# Altium schematic sheet USB_HUB.SchDoc: USB_HUB
size A3; Date: Not used; ApprovedBy: Not used; CheckedBy: Not used; Author: Not used; CompanyName: STMicroelectronics; DrawnBy: Not used; Engineer: Not used; Organization: Not used; Address1: Not used; Address2: Not used; Address3: Not used; Address4: Not used; DocumentNumber: Not used; Revision: Not used; SheetNumber: 14; SheetTotal: 18; CurrentTime: Not used; CurrentDate: Not used; Time: Not used; DocumentFullPathAndName: Not used; DocumentName: Not used; ModifiedDate: Not used; ImagePath: Not used; ProjectName: Not used; Application_BuildNumber: Not used
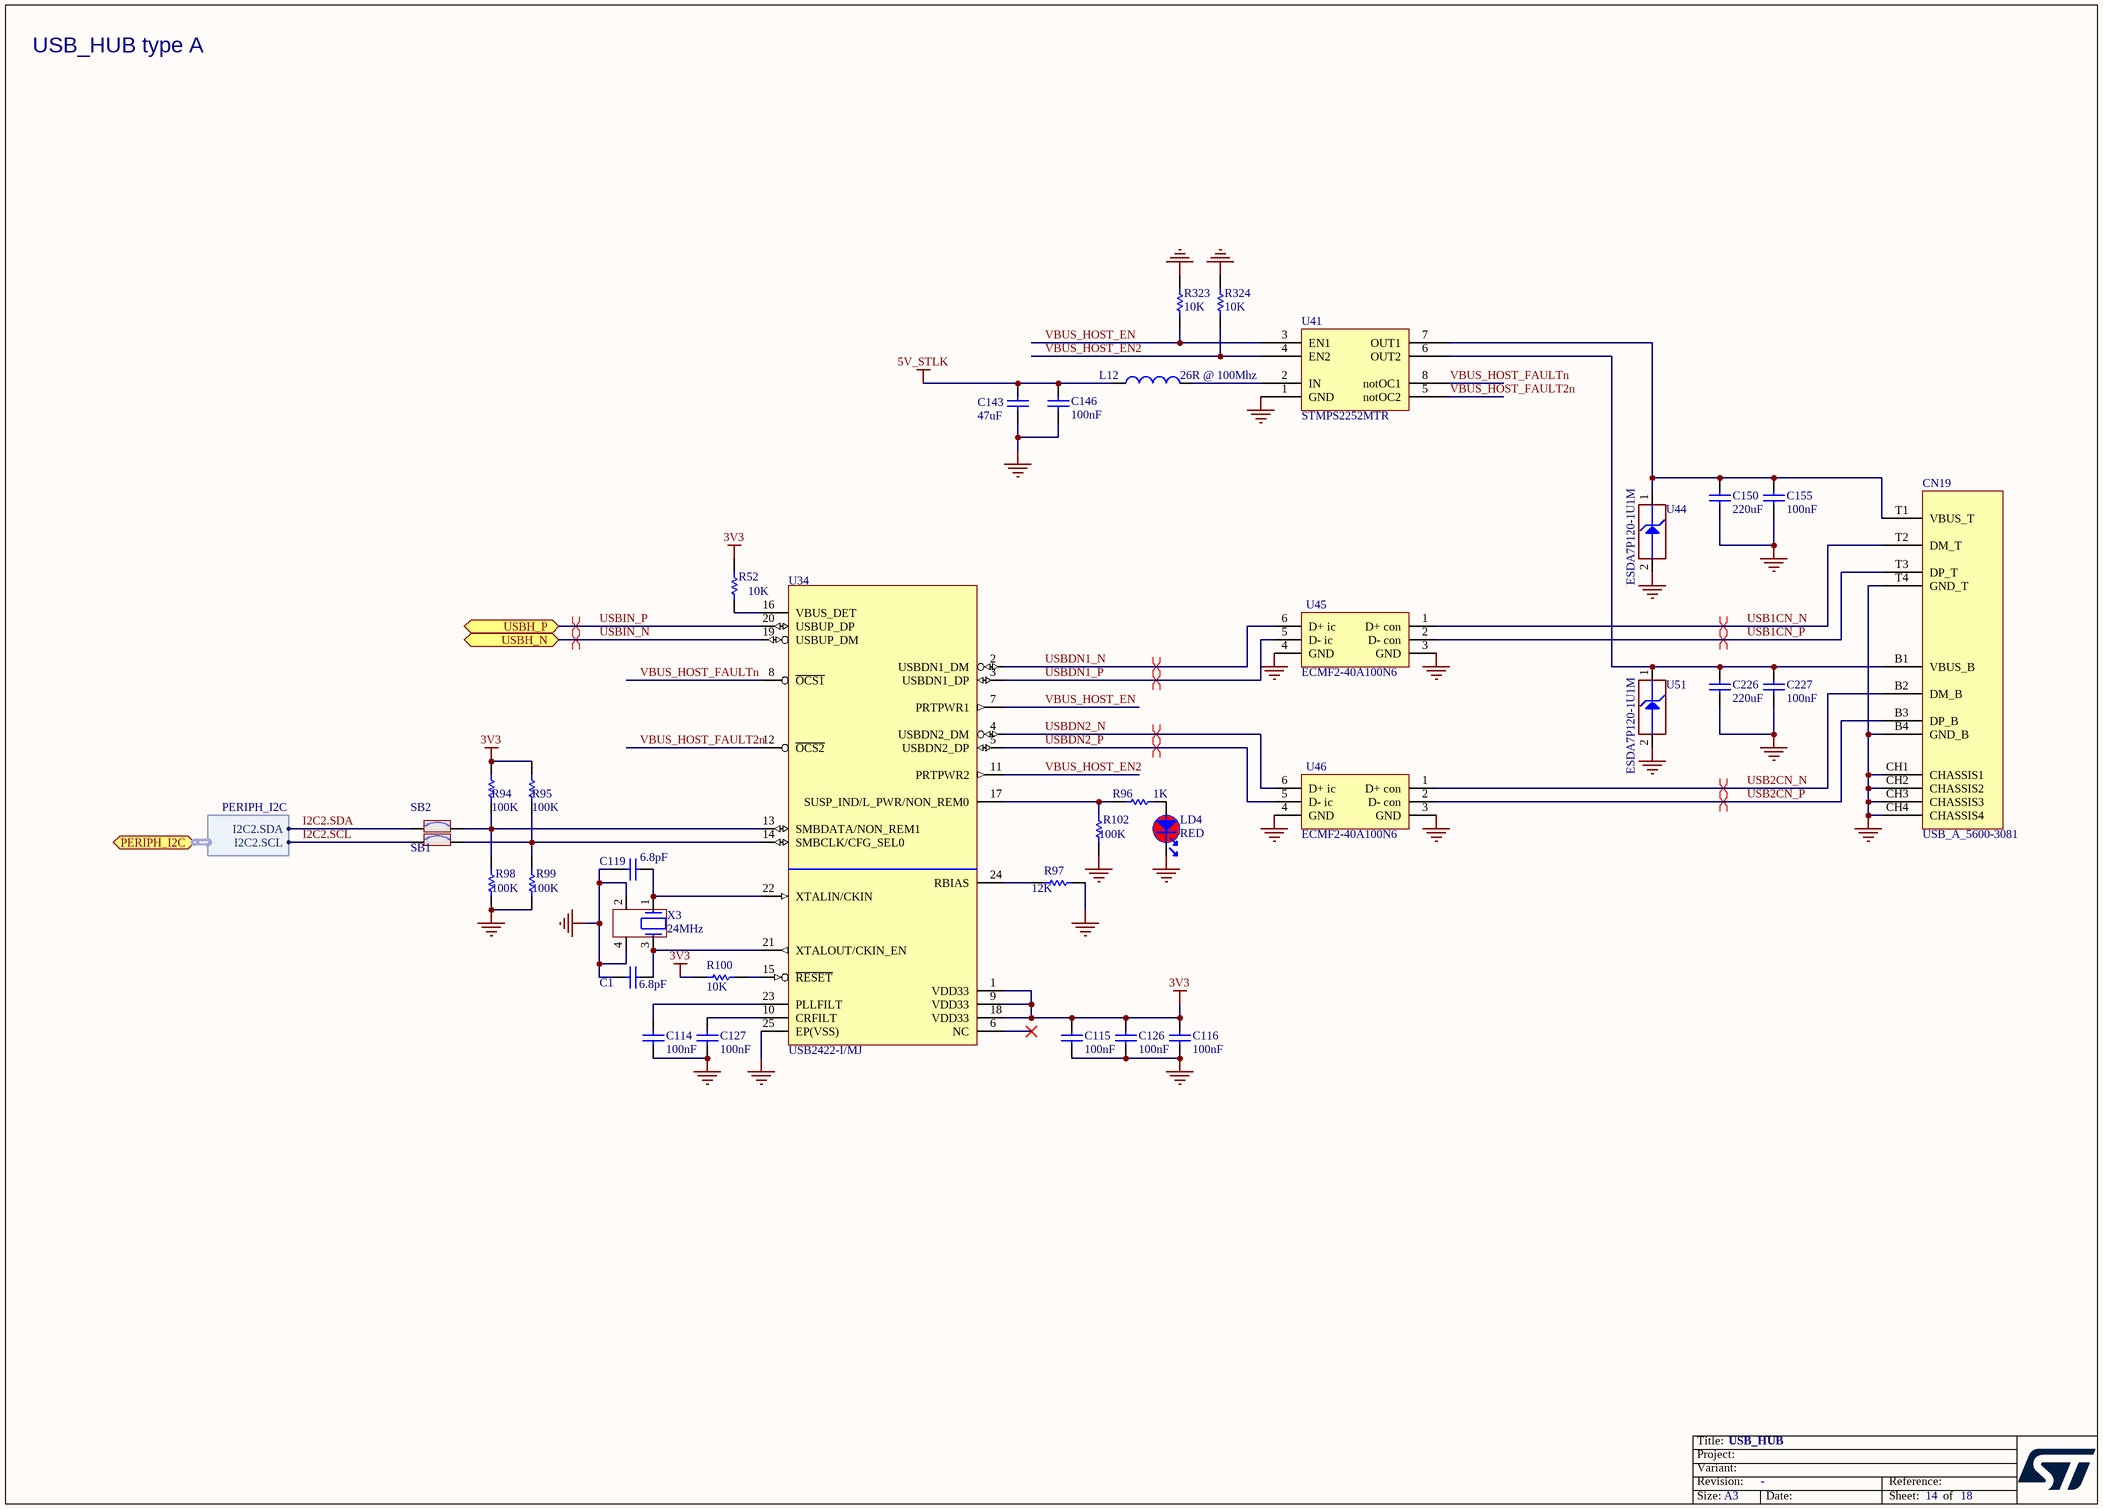
[diagram p0: USB_HUB.SchDoc]

## Parts
C1  value 6.8pF  [C0402]  (hidden comment: Capacitor)
C114  value 100nF  [C0402]  (hidden comment: Capacitor)
C115  value 100nF  [C0402]  (hidden comment: Capacitor)
C116  value 100nF  [C0402]  (hidden comment: Capacitor)
C119  value 6.8pF  [C0402]  (hidden comment: Capacitor)
C126  value 100nF  [C0402]  (hidden comment: Capacitor)
C127  value 100nF  [C0402]  (hidden comment: Capacitor)
C143  value 47uF  [C0805]  (hidden comment: Capacitor)
C146  value 100nF  [C0402]  (hidden comment: Capacitor)
C150  value 220uF  [C1206_H1P6]  (hidden comment: Capacitor)
C155  value 100nF  [C0402]  (hidden comment: Capacitor)
C226  value 220uF  [C1206_H1P6]  (hidden comment: Capacitor)
C227  value 100nF  [C0402]  (hidden comment: Capacitor)
CN19  value USB_A_5600-3081  [CON_DUAL-USB-TYPE-A_CONEXCON_5600-3081]  (hidden comment: USB_DUAL_TYPEA_5600-3081)
L12  value 26R @ 100Mhz  [FIL_0603_H0P65]  (hidden comment: BEAD)
LD4  value RED  [LED_0603_VISHAY_VLMS1300-GS08_RED_1A2K_H0P8]  (hidden comment: LED_red)
R52  value 10K  [R0402]  (hidden comment: Resistor)
R94  value 100K  [R0402]  (hidden comment: Resistor)
R95  value 100K  [R0402]  (hidden comment: Resistor)
R96  value 1K  [R0402]  (hidden comment: Resistor)
R97  value 12K  [R0402]  (hidden comment: Resistor)
R98  value 100K  [R0402]  (hidden comment: Resistor)
R99  value 100K  [R0402]  (hidden comment: Resistor)
R100  value 10K  [R0402]  (hidden comment: Resistor)
R102  value 100K  [R0402]  (hidden comment: Resistor)
R323  value 10K  [R0402]  (hidden comment: Resistor)
R324  value 10K  [R0402]  (hidden comment: Resistor)
SB1  SB_ON  [SOLDER-BRIDGE_R0603-0R]  (value not drawn)
SB2  SB_ON  [SOLDER-BRIDGE_R0603-0R]  (value not drawn)
U34  USB2422-I/MJ  [ICC_SQFN24-EPAD_4X4_P050]
U41  STMPS2252MTR  [ICC_SO8_5X4_P127]
U44  value ESDA7P120-1U1M  [ESD_QFN1610_2N_1K_2A]  (hidden comment: ESD-TRANSIL)
U45  ECMF2-40A100N6  [ESD_UQFN-6L_1P45X1P4_P040]
U46  ECMF2-40A100N6  [ESD_UQFN-6L_1P45X1P4_P040]
U51  value ESDA7P120-1U1M  [ESD_QFN1610_2N_1K_2A]  (hidden comment: ESD-TRANSIL)
X3  value 24MHz  [CRY_NX2016SA_4P]  (hidden comment: XTAL_4_PINS)

## Ports
PERIPH_I2C (bidir, harness PERIPH_I2C), USBH_N (bidir), USBH_P (bidir)

## Harnesses
PERIPH_I2C: I2C2.SDA, I2C2.SCL

## Nets
3V3: C115.2 C116.2 C126.2 R52.2 R94.2 R95.2 R100.1 U34.1(VDD33) U34.9(VDD33) U34.18(VDD33)
5V_STLK: C143.2 C146.2 L12.1
GND: C1.1 C114.1 C115.1 C116.1 C119.1 C126.1 C127.1 C143.1 C146.1 C150.1 C155.1 C226.1 C227.1 CN19.B4(GND_B) CN19.CH1(CHASSIS1) CN19.CH2(CHASSIS2) CN19.CH3(CHASSIS3) CN19.CH4(CHASSIS4) CN19.T4(GND_T) LD4.2 R97.1 R98.1 R99.1 R102.1 R323.1 R324.1 U34.25(EP(VSS)) U41.1(GND) U44.2(GND) U45.3(GND) U45.4(GND) U46.3(GND) U46.4(GND) U51.2(GND) X3.2 X3.4
I2C2.SCL: SB1.1 ; port PERIPH_I2C.I2C2.SCL
I2C2.SDA: SB2.1 ; port PERIPH_I2C.I2C2.SDA
USB1CN_N: CN19.T2(DM_T) U45.1(D+_con)
USB1CN_P: CN19.T3(DP_T) U45.2(D-_con)
USB2CN_N: CN19.B2(DM_B) U46.1(D+_con)
USB2CN_P: CN19.B3(DP_B) U46.2(D-_con)
USBDN1_N: U34.2(USBDN1_DM) U45.6(D+_ic)
USBDN1_P: U34.3(USBDN1_DP) U45.5(D-_ic)
USBDN2_N: U34.4(USBDN2_DM) U46.6(D+_ic)
USBDN2_P: U34.5(USBDN2_DP) U46.5(D-_ic)
USBIN_N: U34.19(USBUP_DM) ; port USBH_N
USBIN_P: U34.20(USBUP_DP) ; port USBH_P
VBUS_HOST_EN: R323.2 U34.7(PRTPWR1) U41.3(EN1)
VBUS_HOST_EN2: R324.2 U34.11(PRTPWR2) U41.4(EN2)
VBUS_HOST_FAULT2n: U34.12(~{OCS2}) U41.5(notOC2)
VBUS_HOST_FAULTn: U34.8(~{OCS1}) U41.8(notOC1)
NetC1_2: C1.2 U34.21(XTALOUT/CKIN_EN) X3.3
NetC114_2: C114.2 U34.23(PLLFILT)
NetC119_2: C119.2 U34.22(XTALIN/CKIN) X3.1
NetC127_2: C127.2 U34.10(CRFILT)
NetC150_2: C150.2 C155.2 CN19.T1(VBUS_T) U41.7(OUT1) U44.1(IO1)
NetC226_2: C226.2 C227.2 CN19.B1(VBUS_B) U41.6(OUT2) U51.1(IO1)
NetL12_2: L12.2 U41.2(IN)
NetLD4_1: LD4.1 R96.1
NetR52_1: R52.1 U34.16(VBUS_DET)
NetR94_1: R94.1 R98.2 SB2.2 U34.13(SMBDATA/NON_REM1)
NetR95_1: R95.1 R99.2 SB1.2 U34.14(SMBCLK/CFG_SEL0)
NetR96_2: R96.2 R102.2 U34.17(SUSP_IND/L_PWR/NON_REM0)
NetR97_2: R97.2 U34.24(RBIAS)
NetR100_2: R100.2 U34.15(~{RESET})

Not connected (* = marked no-connect by the designer): U34 6(NC)*

## Layout directives
differential pair: USB1CN_N, USB1CN_P, USB2CN_N, USB2CN_P, USBDN1_N, USBDN1_P, USBDN2_N, USBDN2_P, USBIN_N, USBIN_P

## Notes on the sheet
- USB_HUB type A
- Title:
- Project:
- Size:
- Revision:
- Variant:
- A3
- -
- Date:
- Reference:
- Sheet:
- of
- (in symbol MCD-02348) Upstream; Downstream 1; Downstream 2; Config; Common

## Library data of the parts
C1 C119 = MCD-00674: Capacitor, MLCC, 6.8pF, 50V, NPO, +-0.25pF, 0402, T=0.5mm; Manufacturer_Part_Number: CC0402CRNPO9BN6R8; Manufacturer: YAGEO; Part_Preference: Recommended; Provided_By: SUBCO; Component_Country_Of_Origin: China; ID: 3068; ShowFields: YES; Internal_Part_Number: MCD-00674; Status: Released; Part_Type: Capacitor; Package: 0402; ComponentLink1Description: Datasheet; ComponentLink1URL: http://tunmcdsvn.tun.st.com/Component_Documentation_Library/Trunk/Capacitor/YAGEO_NP0_Series; Alternate_Manufacturer: N/A; Alternate_Manufacturer_Part_Number: N/A; Order_Code_Digikey: 311-3327-1-ND; Order_Code_Farnell: N/A; Order_Code_RS: N/A
C114-C116 C126 C127 = MCD-00006: Capacitor, MLCC, 100nF, 16V, X7R, +/-10%, 0402, T=0.5mm; Manufacturer_Part_Number: CC0402KRX7R7BB104; Manufacturer: YAGEO; Alternate_Manufacturer: MURATA; Alternate_Manufacturer_Part_Number: GCM155R71C104KA55D; Part_Preference: Recommended; Partial_Alternate_Internal_Part_Number: MCD-03299; Order_Code_RS: 616-9701; Component_Country_Of_Origin: China; Alternate_EMS: M; ID: 2474; ShowFields: YES; Internal_Part_Number: MCD-00006; Status: Released; Part_Type: Capacitor; Package: 0402; ComponentLink1URL: http://tunmcdsvn.tun.st.com/Component_Documentation_Library/Trunk/Capacitor/YAGEO_X7R_Series; Order_Code_Digikey: 311-1338-1-ND; Order_Code_Farnell: 9402047
C143 = MCD-00204: Capacitor, MLCC, 47uF, 10V, X5R, +/-20%, 0805, T=1.25mm; Part_Preference: Recommended; Manufacturer: MURATA; Manufacturer_Part_Number: GRM21BR61A476ME15K; Component_Country_Of_Origin: Japan; ShowFields: YES; ID: 2664; Internal_Part_Number: MCD-00204; Status: Checked; Part_Type: Capacitor; Package: 0805; ComponentLink1URL: http://tunmcdsvn.tun.st.com/Component_Documentation_Library/Trunk/Capacitor/MURATA_GRM_Series; Order_Code_Digikey: GRM21BR61A476ME15K-ND; Order_Code_Farnell: N/A; Order_Code_RS: N/A
C146 C155 C227 = MCD-00006: Capacitor, MLCC, 100nF, 16V, X7R, +/-10%, 0402, T=0.5mm; Manufacturer_Part_Number: CC0402KRX7R7BB104; Manufacturer: YAGEO; Part_Preference: Recommended; Partial_Alternate_Internal_Part_Number: MCD-03299; Order_Code_RS: 616-9701; Component_Country_Of_Origin: China; Alternate_EMS: M; ID: 2474; ShowFields: YES; Internal_Part_Number: MCD-00006; Status: Released; Part_Type: Capacitor; Package: 0402; ComponentLink1URL: http://tunmcdsvn.tun.st.com/Component_Documentation_Library/Trunk/Capacitor/YAGEO_X7R_Series; Order_Code_Digikey: 311-1338-1-ND; Order_Code_Farnell: 9402047
C150 C226 = MCD-00104: Capacitor, MLCC, 220uF, 6V3, X5R, +/-20%, 1206, T=1.6mm; Manufacturer_Part_Number: GRM31CR60J227ME11; Manufacturer: MURATA; Part_Preference: Recommended; Order_Code_RS: 170-6396; Component_Country_Of_Origin: Japan; ID: 2764; ShowFields: YES; Internal_Part_Number: MCD-00104; Status: Released; Part_Type: Capacitor; Package: 1206; ComponentLink1URL: http://tunmcdsvn.tun.st.com/Component_Documentation_Library/Trunk/Capacitor/MURATA_GRM_Series; Order_Code_Digikey: 490-13970-1-ND; Order_Code_Farnell: 2494472
CN19 = MCD-00109: USB_Dual-TypeA, Receptacle, 8pins, 2.5mm, RA, TH, T= 15.5mm; Manufacturer: CONEXCON; Part_Type: Connector; Part_Preference: Recommended; Component_Country_Of_Origin: Unknown; ID: 2756; ShowFields: YES; Internal_Part_Number: MCD-00109; Manufacturer_Part_Number: 5600-3081; Status: Released; ComponentLink1URL: http://tunmcdsvn.tun.st.com/Component_Documentation_Library/Trunk/Connector/CONEXCON_5600_Series/; Order_Code_Digikey: N/A; Order_Code_Farnell: N/A; Order_Code_RS: N/A
L12 = MCD-00305: Ferrite bead, 26R @ 100Mhz, +/-25%, 6000mA, 0R007, 0603, T=0.75mm; Manufacturer_Part_Number: BLM18KG260TN1; Manufacturer: MURATA; Part_Type: Inductor; Part_Preference: Recommended; Order_Code_RS: 747-4723; Component_Country_Of_Origin: Japan; ID: 2564; ShowFields: YES; Internal_Part_Number: MCD-00305; Status: Checked; ComponentLink1URL: http://tunmcdsvn.tun.st.com/Component_Documentation_Library/Trunk/Inductor/MURATA_BLM_Series; Order_Code_Digikey: 490-5252-2-ND; Order_Code_Farnell: 1781087; Package: 0603
LD4 = MCD-00587: LED Red, 0603 SMD, 2V Forward Voltage; Part_Type: Display; Manufacturer_Part_Number: VLMS1300-GS08; Manufacturer: VISHAY; Alternate_Manufacturer_Part_Number: LS Q976-NR-1; Alternate_Manufacturer: OSRAM OPTO SEMICONDUCTORS; Alternate_Internal_Part_Number: MCD-02401; Part_Preference: Recommended; Provided_By: SUBCO; Component_Country_Of_Origin: China; ID: 3154; ShowFields: YES; Internal_Part_Number: MCD-00587; Status: Released; Package: LED 0603; ComponentLink1Description: Datasheet; ComponentLink1URL: http://tunmcdsvn.tun.st.com/Component_Documentation_Library/Trunk/Display/VISHAY_VLMx1300-GS08_Series; Order_Code_Digikey: VLMS1300-GS08CT-ND; Order_Code_Farnell: 2078728; ECCN_US: n/a; ECCN_EU: n/a; Order_Code_RS: N/A; Full_Alternate_Internal_Part_Number: MCD-02401
R52 R100 = MCD-00053: Resistor,10K,0402,1%,1/16W; Manufacturer_Part_Number: RC0402FR-0710KL; Manufacturer: YAGEO; BMS_Part_Number: 9131590; Part_Preference: Recommended; Provided_By: SUBCO; Initial_Board_Reference: MB1274; Component_Country_Of_Origin: China; ID: 2539; ShowFields: YES; Internal_Part_Number: MCD-00053; ComponentLink1Description: Datasheet; ECCN_US: n/a; ECCN_EU: n/a; Status: Released; Part_Type: Resistor; ComponentLink1URL: http://tunmcdsvn.tun.st.com/Component_Documentation_Library/Trunk/Resistor/YAGEO_RC_L_Series; Package: 0402; Alternate_Manufacturer: N/A; Alternate_Manufacturer_Part_Number: N/A; Order_Code_Digikey: 311-10.0KLRCT-ND; Order_Code_Farnell: 9239359; Order_Code_RS: N/A
R94 R95 R98 R99 R102 = MCD-00059: Resistor,100K,0402,1%,1/16W; Manufacturer_Part_Number: RC0402FR-07100KL; Manufacturer: YAGEO; Alternate_Manufacturer_Part_Number: RT0402FRE07100KL; Part_Preference: Recommended; Partial_Alternate_Internal_Part_Number: MCD-03301; Provided_By: SUBCO; Initial_Board_Reference: MB1274; Component_Country_Of_Origin: China; Alternate_EMS: M; ID: 2533; ShowFields: YES; Internal_Part_Number: MCD-00059; Alternate_Manufacturer: YAGEO; ComponentLink1Description: Datasheet; ECCN_US: n/a; ECCN_EU: n/a; Status: Released; Part_Type: Resistor; ComponentLink1URL: http://tunmcdsvn.tun.st.com/Component_Documentation_Library/Trunk/Resistor/YAGEO_RC_L_Series; Package: 0402; Order_Code_Digikey: 311-100KLRTR-ND; Order_Code_Farnell: 2421891; Order_Code_RS: N/A
R96 = MCD-00061: Resistor,1K,0402,1%,1/16W; Manufacturer_Part_Number: RC0402FR-071KL; Manufacturer: YAGEO; Part_Preference: Recommended; Provided_By: SUBCO; Initial_Board_Reference: MB1274; Component_Country_Of_Origin: China; ID: 2532; ShowFields: YES; Internal_Part_Number: MCD-00061; ComponentLink1Description: Datasheet; ECCN_US: n/a; ECCN_EU: n/a; Status: Released; Part_Type: Resistor; ComponentLink1URL: http://tunmcdsvn.tun.st.com/Component_Documentation_Library/Trunk/Resistor/YAGEO_RC_L_Series; Package: 0402; Alternate_Manufacturer: N/A; Alternate_Manufacturer_Part_Number: N/A; Order_Code_Digikey: 311-1.00KLRCT-ND; Order_Code_Farnell: 9239235; Order_Code_RS: N/A
R97 = MCD-00187: Resistor,12K,0402,1%,1/16W; Manufacturer_Part_Number: RC0402FR-0712KL; Manufacturer: YAGEO; BMS_Part_Number: 9131030; Part_Preference: Recommended; Provided_By: SUBCO; Component_Country_Of_Origin: China; ID: 2678; ShowFields: YES; Internal_Part_Number: MCD-00187; ComponentLink1Description: Datasheet; ECCN_US: n/a; ECCN_EU: n/a; Status: Released; Part_Type: Resistor; ComponentLink1URL: http://tunmcdsvn.tun.st.com/Component_Documentation_Library/Trunk/Resistor/YAGEO_RC_L_Series; Package: 0402; Alternate_Manufacturer: N/A; Alternate_Manufacturer_Part_Number: N/A; Order_Code_Digikey: 311-12.0KLRCT-ND; Order_Code_Farnell: 9239367; Order_Code_RS: N/A
R323 R324 = MCD-00053: Resistor, 10K, 0402, +/-1%, 1/16W; Manufacturer_Part_Number: RC0402FR-0710KL; Manufacturer: YAGEO; BMS_Part_Number: 9131590; Part_Preference: Recommended; Component_Country_Of_Origin: China; ID: 2539; ShowFields: YES; Internal_Part_Number: MCD-00053; Status: Released; Part_Type: Resistor; ComponentLink1URL: http://tunmcdsvn.tun.st.com/Component_Documentation_Library/Trunk/Resistor/YAGEO_RC_L_Series; Package: 0402; Order_Code_Digikey: 311-10.0KLRCT-ND; Order_Code_Farnell: 9239359; Order_Code_RS: N/A
SB1 SB2 = MCD-00071: Solder Bridge ON; Part_Preference: Recommended; Part_Type: Misc; Manufacturer: YAGEO; Manufacturer_Part_Number: RC0603JR-070RL; ID: 2521; ShowFields: YES; Internal_Part_Number: MCD-00071; Status: Released; Package: SB0603; ComponentLink1Description: Datasheet; ComponentLink1URL: http://tunmcdsvn.tun.st.com/Component_Datasheet_Library/Trunk/Resistors/Yageo_Resistor_RC0603-series
U34 = MCD-02348: 2xPort USB 2.0 Hi-Speed Hub Controller; Part_Type: IC; Part_Preference: Recommended; Manufacturer: MICROCHIP; Order_Code_RS: 165-2143; Component_Country_Of_Origin: Unknown; ID: 4454; ShowFields: YES; Internal_Part_Number: MCD-02348; Value: USB2422-I/MJ; Status: Checked; Manufacturer_Part_Number: USB2422-I/MJ; Alternate_Manufacturer: N/A; Alternate_Manufacturer_Part_Number: N/A; Package: 24-SQFN; ComponentLink1URL: http://tunmcdsvn.tun.st.com/Component_Documentation_Library/Trunk/IC/MICROCHIP_USB2422-IMJ/; Order_Code_Digikey: USB2422-I/MJ-ND; Order_Code_Farnell: 2409613
U41 = MCD-00123: IC,Dual-Channel-Power-Switch,500mA,100mR,SO8; Manufacturer: STMICROELECTRONICS; BMS_Part_Number: 9159012; Part_Preference: Recommended; Manufacturer_HQ_COO: EU; Component_Country_Of_Origin: China; ID: 2746; ShowFields: YES; Value: STMPS2252MTR; Internal_Part_Number: MCD-00123; Manufacturer_Part_Number: STMPS2252MTR; Status: Released; Part_Type: IC; ComponentLink1URL: http://tunmcdsvn.tun.st.com/Component_Documentation_Library/Trunk/IC/STMICROELECTRONICS_STMPS2252MTR; Order_Code_Digikey: N/A; Order_Code_Farnell: N/A; Order_Code_RS: N/A
U44 U51 = MCD-01026: High power transient voltage suppressor; Part_Type: Diode; Manufacturer: STMICROELECTRONICS; BMS_Part_Number: 9179046; Part_Preference: Recommended; Manufacturer_HQ_COO: EU; Component_Country_Of_Origin: China; ID: 2997; ShowFields: YES; Internal_Part_Number: MCD-01026; Status: Released; Manufacturer_Part_Number: ESDA7P120-1U1M; Package: QFN1610; ComponentLink1URL: http://tunmcdsvn.tun.st.com/Component_Documentation_Library/Trunk/Diode/STMICROELECTRONICS_ESDA7P120-1U1M; Order_Code_Digikey: N/A; Order_Code_Farnell: N/A; Order_Code_RS: N/A
U45 U46 = MCD-03060: ESD protection & Common Filter High Speed serial Interfaces , 0.4 pitch; Part_Type: IC; Part_Preference: Recommended; Manufacturer: STMICROELECTRONICS; ShowFields: YES; ID: 5176; Component_Country_Of_Origin: China; ComponentLink1Description: Datasheet; ComponentLink1URL: http://tunmcdsvn.tun.st.com/Component_Documentation_Library/Trunk/IC/STMICROELECTRONICS_ECMF4-40A100N10; Internal_Part_Number: MCD-03060; Value: ECMF2-40A100N6; Status: Checked; Manufacturer_Part_Number: ECMF2-40A100N6; Package: uQFN-6; Order_Code_Digikey: 497-ECMF2-40A100N6; Order_Code_Farnell: 3993603; Order_Code_RS: N/A
X3 = MCD-01036: Crystal 24MHz, 6pF, +-20ppm, 80ohms max, SMD; Part_Type: Crystal_Osc; Manufacturer_Part_Number: NX2016SA-24MHZ-EXS00A-CS10820; Manufacturer: NDK; BMS_Part_Number: 9157045; Part_Preference: Recommended; Provided_By: SUBCO; Component_Country_Of_Origin: Unknown; ID: 2989; ShowFields: YES; Internal_Part_Number: MCD-01036; Status: Released; Package: 2x1.6mm; ComponentLink1Description: Datasheet; ComponentLink1URL: http://tunmcdsvn.tun.st.com/Component_Documentation_Library/Trunk/Crytal_Oscillator/NDK_NX2016SA_Series; Alternate_Manufacturer: N/A; Alternate_Manufacturer_Part_Number: N/A; Order_Code_Digikey: 644-1365; Order_Code_Farnell: N/A; Order_Code_RS: N/A